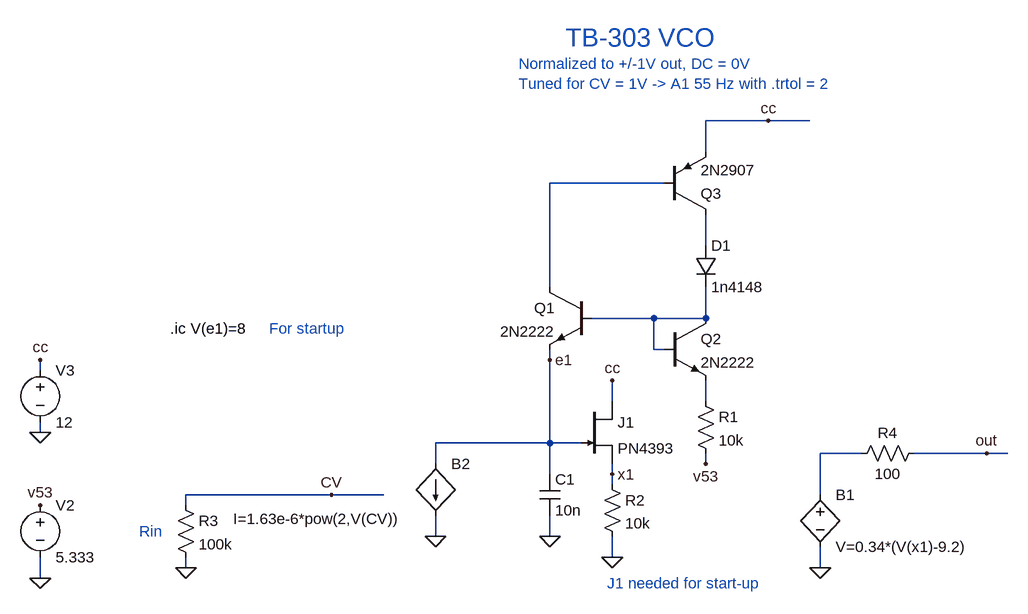
[diagram p0: schematic vco.asc]
vco.asc, the LTspice schematic file:
Version 4
SHEET 1 1100 1252
WIRE 432 -176 336 -176
WIRE 496 -176 432 -176
WIRE 336 -128 336 -176
WIRE 272 -80 96 -80
WIRE 336 16 336 -32
WIRE 96 80 96 -80
WIRE 256 128 160 128
WIRE 336 128 336 80
WIRE 336 128 256 128
WIRE 256 176 256 128
WIRE 272 176 256 176
WIRE 96 192 96 176
WIRE -688 208 -688 192
WIRE 192 256 192 224
WIRE 336 256 336 224
WIRE -688 304 -688 288
WIRE 96 320 96 192
WIRE 96 320 -80 320
WIRE 144 320 96 320
WIRE 576 336 512 336
WIRE 768 336 656 336
WIRE 800 336 768 336
WIRE -80 352 -80 320
WIRE 336 352 336 336
WIRE 96 368 96 320
WIRE 192 368 192 352
WIRE 192 384 192 368
WIRE -240 400 -464 400
WIRE -160 400 -240 400
WIRE 512 400 512 336
WIRE -464 416 -464 400
WIRE -80 464 -80 432
WIRE 96 464 96 432
WIRE 192 496 192 464
WIRE -464 512 -464 496
WIRE 512 512 512 480
WIRE -688 528 -688 496
FLAG 96 464 0
FLAG 96 192 e1
FLAG 432 -176 cc
FLAG 192 496 0
FLAG 192 224 cc
FLAG 192 368 x1
FLAG 336 352 v53
FLAG 512 512 0
FLAG 768 336 out
FLAG -688 528 0
FLAG -688 304 0
FLAG -688 416 v53
FLAG -688 192 cc
FLAG -80 464 0
FLAG -240 400 CV
FLAG -464 512 0
SYMBOL npn 160 80 M0
SYMATTR InstName Q1
SYMATTR Value 2N2222
SYMBOL npn 272 128 R0
SYMATTR InstName Q2
SYMATTR Value 2N2222
SYMBOL diode 320 16 R0
SYMATTR InstName D1
SYMATTR Value 1n4148
SYMBOL pnp 272 -32 M180
SYMATTR InstName Q3
SYMATTR Value 2N2907
SYMBOL res 320 240 R0
SYMATTR InstName R1
SYMATTR Value 10k
SYMBOL cap 80 368 R0
SYMATTR InstName C1
SYMATTR Value 10n
SYMBOL njf 144 256 R0
SYMATTR InstName J1
SYMATTR Value PN4393
SYMBOL res 176 368 R0
SYMATTR InstName R2
SYMATTR Value 10k
SYMBOL bv 512 384 R0
SYMATTR InstName B1
SYMATTR Value V=0.34*(V(x1)-9.2)
SYMBOL voltage -688 400 R0
SYMATTR InstName V2
SYMATTR Value 5.333
SYMBOL voltage -688 192 R0
SYMATTR InstName V3
SYMATTR Value 12
SYMBOL bi -80 352 R0
WINDOW 3 -311 85 Left 2
SYMATTR Value I=1.63e-6*pow(2,V(CV))
SYMATTR InstName B2
SYMBOL res -480 400 R0
SYMATTR InstName R3
SYMATTR Value 100k
SYMBOL res 672 320 R90
WINDOW 0 0 56 VBottom 2
WINDOW 3 32 56 VTop 2
SYMATTR InstName R4
SYMATTR Value 100
TEXT -488 144 Left 2 !.ic V(e1)=8
TEXT 120 -304 Left 4 ;TB-303 VCO
TEXT 184 536 Left 2 ;J1 needed for start-up
TEXT 48 -264 Left 2 ;Normalized to +/-1V out, DC = 0V\nTuned for CV = 1V -> A1 55 Hz with .trtol = 2
TEXT -336 144 Left 2 ;For startup
TEXT -536 456 Left 2 ;Rin

The netlist it stands for:
* vco.asc
Q1 N001 N003 e1 0 2N2222
Q2 N003 N003 N004 0 2N2222
D1 N002 N003 1n4148
Q3 N002 N001 cc 0 2N2907
R1 N004 v53 10k
C1 e1 0 10n
J1 cc e1 x1 PN4393
R2 x1 0 10k
B1 N005 0 V=0.34*(V(x1)-9.2)
V2 v53 0 5.333
V3 cc 0 12
B2 e1 0 I=1.63e-6*pow(2,V(CV))
R3 CV 0 100k
R4 out N005 100
.model D D
.lib standard.dio
.model NPN NPN
.model PNP PNP
.lib standard.bjt
.model NJF NJF
.model PJF PJF
.lib standard.jft
.ic V(e1)=8
* TB-303 VCO
* J1 needed for start-up
* Normalized to +/-1V out, DC = 0V
* Tuned for CV = 1V -> A1 55 Hz with .trtol = 2
* For startup
* Rin
.backanno
.end